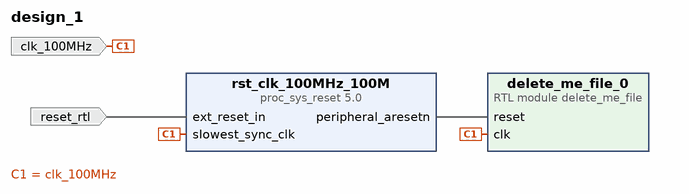
[diagram p0: block diagram of the top level]
# Vivado block design design_1, xc7z010clg225-1, Vivado 2018.2
create_bd_design design_1

create_bd_port -dir I -type clk clk_100MHz
set_property -dict {CONFIG.FREQ_HZ 100000000} [get_bd_ports clk_100MHz]
create_bd_port -dir I -type rst reset_rtl
set_property -dict {CONFIG.POLARITY ACTIVE_LOW} [get_bd_ports reset_rtl]

create_bd_cell -type module -reference delete_me_file delete_me_file_0
create_bd_cell -type ip -vlnv xilinx.com:ip:proc_sys_reset:5.0 rst_clk_100MHz_100M

# ---- connections ----

connect_bd_net [get_bd_ports clk_100MHz] [get_bd_pins delete_me_file_0/clk] [get_bd_pins rst_clk_100MHz_100M/slowest_sync_clk]
connect_bd_net [get_bd_pins rst_clk_100MHz_100M/peripheral_aresetn] [get_bd_pins delete_me_file_0/reset]
connect_bd_net [get_bd_ports reset_rtl] [get_bd_pins rst_clk_100MHz_100M/ext_reset_in]

validate_bd_design
save_bd_design
